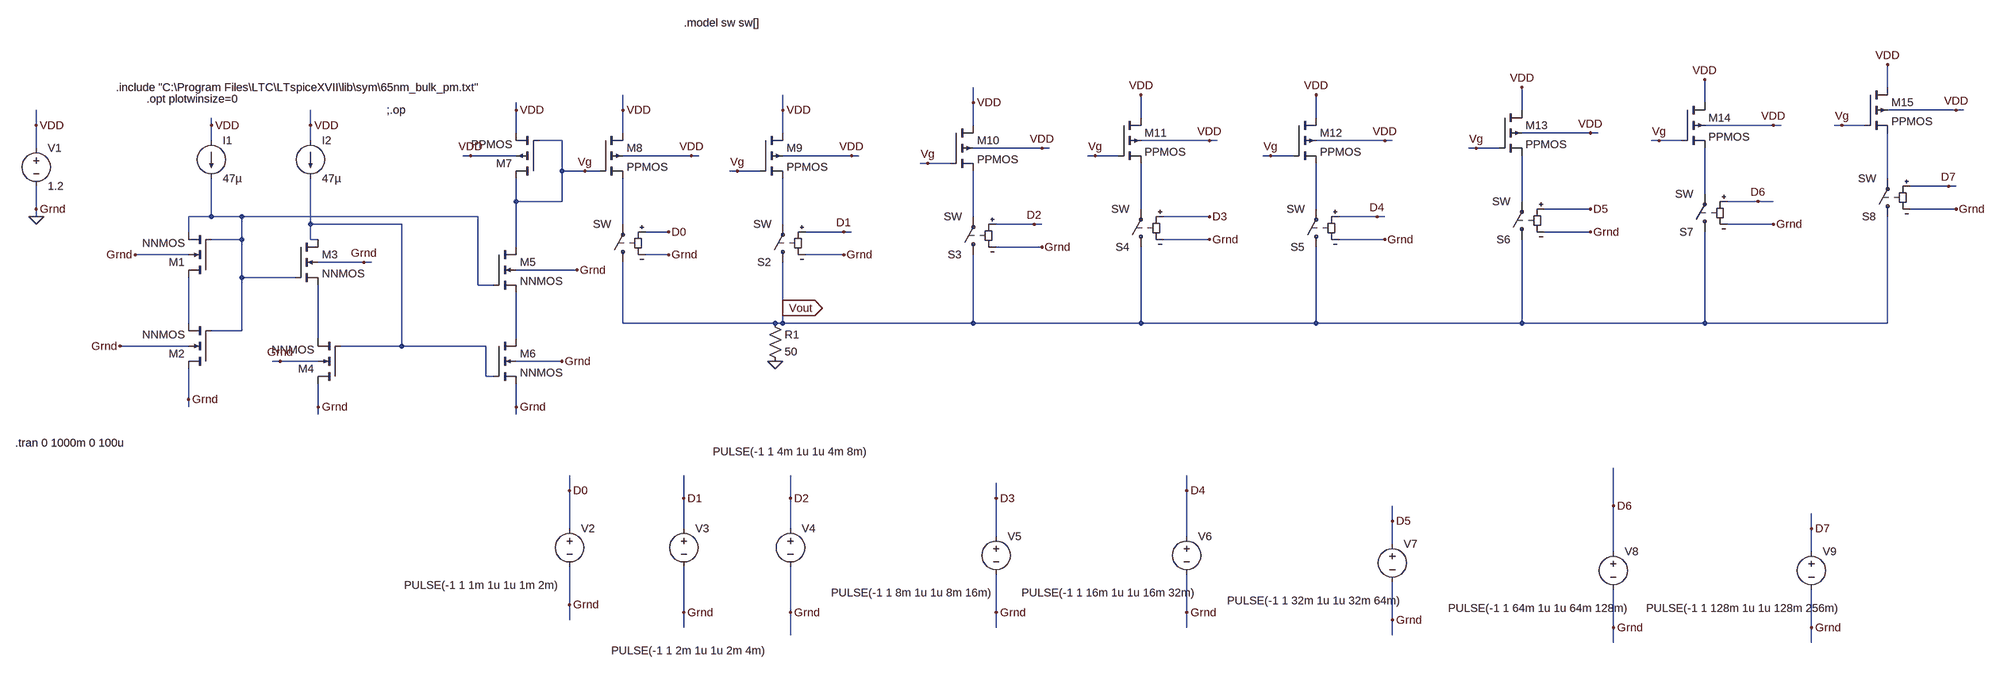
[diagram p0: schematic 8bitDAC.asc]
8bitDAC.asc, the LTspice schematic file:
Version 4
SHEET 1 3804 680
WIRE 3584 -624 3584 -672
WIRE 1664 -592 1664 -624
WIRE 3200 -592 3200 -640
WIRE 704 -576 704 -592
WIRE 928 -576 928 -608
WIRE 1264 -576 1264 -608
WIRE 2816 -576 2816 -624
WIRE 3728 -576 3584 -576
WIRE 3744 -576 3728 -576
WIRE 2016 -560 2016 -608
WIRE 2384 -560 2384 -608
WIRE -304 -544 -304 -576
WIRE 64 -544 64 -560
WIRE 272 -544 272 -576
WIRE 1664 -544 1664 -592
WIRE 3344 -544 3200 -544
WIRE 3360 -544 3344 -544
WIRE 3488 -544 3472 -544
WIRE 3536 -544 3488 -544
WIRE 704 -528 704 -576
WIRE 928 -528 928 -576
WIRE 1264 -528 1264 -576
WIRE 2960 -528 2816 -528
WIRE 2976 -528 2960 -528
WIRE 64 -512 64 -544
WIRE 272 -512 272 -544
WIRE 800 -512 752 -512
WIRE 2160 -512 2016 -512
WIRE 2176 -512 2160 -512
WIRE 2528 -512 2384 -512
WIRE 2544 -512 2528 -512
WIRE 3104 -512 3088 -512
WIRE 3152 -512 3104 -512
WIRE -304 -496 -304 -544
WIRE 1808 -496 1664 -496
WIRE 1824 -496 1808 -496
WIRE 2720 -496 2704 -496
WIRE 2768 -496 2720 -496
WIRE 608 -480 592 -480
WIRE 704 -480 608 -480
WIRE 1072 -480 928 -480
WIRE 1088 -480 1072 -480
WIRE 1408 -480 1264 -480
WIRE 1424 -480 1408 -480
WIRE 1920 -480 1904 -480
WIRE 1968 -480 1920 -480
WIRE 2288 -480 2272 -480
WIRE 2336 -480 2288 -480
WIRE 1568 -464 1552 -464
WIRE 1616 -464 1568 -464
WIRE 800 -448 800 -512
WIRE 848 -448 800 -448
WIRE 880 -448 848 -448
WIRE 1168 -448 1152 -448
WIRE 1216 -448 1168 -448
WIRE 3584 -432 3584 -528
WIRE 3712 -416 3632 -416
WIRE 3728 -416 3712 -416
WIRE 3200 -400 3200 -496
WIRE 704 -384 704 -432
WIRE 800 -384 800 -448
WIRE 800 -384 704 -384
WIRE 2816 -384 2816 -480
WIRE 3312 -384 3248 -384
WIRE 3344 -384 3312 -384
WIRE -304 -368 -304 -416
WIRE 2016 -368 2016 -464
WIRE 2384 -368 2384 -464
WIRE 2960 -368 2864 -368
WIRE 3728 -368 3632 -368
WIRE -304 -352 -304 -368
WIRE 64 -352 64 -432
WIRE 64 -352 16 -352
WIRE 128 -352 64 -352
WIRE 624 -352 128 -352
WIRE 1664 -352 1664 -448
WIRE 2160 -352 2064 -352
WIRE 2512 -352 2432 -352
WIRE 2528 -352 2512 -352
WIRE 272 -336 272 -432
WIRE 464 -336 272 -336
WIRE 928 -336 928 -432
WIRE 1264 -336 1264 -432
WIRE 1792 -336 1712 -336
WIRE 1808 -336 1792 -336
WIRE 3344 -336 3248 -336
WIRE 16 -320 16 -352
WIRE 1024 -320 976 -320
WIRE 1392 -320 1312 -320
WIRE 1408 -320 1392 -320
WIRE 2960 -320 2864 -320
WIRE 128 -304 128 -352
WIRE 128 -304 64 -304
WIRE 272 -304 272 -336
WIRE 288 -304 272 -304
WIRE 2160 -304 2064 -304
WIRE 2528 -304 2432 -304
WIRE 704 -288 704 -384
WIRE 1808 -288 1712 -288
WIRE 16 -272 -96 -272
WIRE 1024 -272 976 -272
WIRE 1392 -272 1312 -272
WIRE 384 -256 288 -256
WIRE 400 -256 384 -256
WIRE 832 -240 704 -240
WIRE 128 -224 128 -304
WIRE 240 -224 128 -224
WIRE 624 -208 624 -352
WIRE 656 -208 624 -208
WIRE 1264 -160 1264 -256
WIRE 16 -128 16 -224
WIRE 928 -128 928 -256
WIRE 1248 -128 928 -128
WIRE 1264 -128 1264 -160
WIRE 1264 -128 1248 -128
WIRE 1664 -128 1664 -272
WIRE 1664 -128 1264 -128
WIRE 2016 -128 2016 -288
WIRE 2016 -128 1664 -128
WIRE 2384 -128 2384 -288
WIRE 2384 -128 2016 -128
WIRE 2816 -128 2816 -304
WIRE 2816 -128 2384 -128
WIRE 3200 -128 3200 -320
WIRE 3200 -128 2816 -128
WIRE 3584 -128 3584 -352
WIRE 3584 -128 3200 -128
WIRE 128 -112 128 -224
WIRE 128 -112 64 -112
WIRE 288 -96 288 -208
WIRE 704 -96 704 -192
WIRE 16 -80 -128 -80
WIRE 464 -80 464 -336
WIRE 464 -80 336 -80
WIRE 640 -80 464 -80
WIRE 208 -48 192 -48
WIRE 288 -48 208 -48
WIRE 800 -48 704 -48
WIRE 640 -16 640 -80
WIRE 656 -16 640 -16
WIRE 16 32 16 -32
WIRE 16 48 16 32
WIRE 288 48 288 0
WIRE 704 48 704 0
WIRE 288 64 288 48
WIRE 704 64 704 48
WIRE 816 224 816 192
WIRE 2112 224 2112 192
WIRE 1056 240 1056 192
WIRE 1280 240 1280 192
WIRE 1712 240 1712 208
WIRE 3008 256 3008 176
WIRE 2544 288 2544 256
WIRE 816 304 816 224
WIRE 1056 304 1056 240
WIRE 1280 304 1280 240
WIRE 3424 304 3424 272
WIRE 1712 320 1712 240
WIRE 2112 320 2112 224
WIRE 2544 336 2544 288
WIRE 3008 352 3008 256
WIRE 3424 352 3424 304
WIRE 816 464 816 384
WIRE 1056 480 1056 384
WIRE 1280 480 1280 384
WIRE 1712 480 1712 400
WIRE 2112 480 2112 400
WIRE 816 496 816 464
WIRE 2544 496 2544 416
WIRE 1056 512 1056 480
WIRE 1712 512 1712 480
WIRE 2112 512 2112 480
WIRE 3008 512 3008 432
WIRE 3424 512 3424 432
WIRE 1280 528 1280 480
WIRE 2544 528 2544 496
WIRE 3008 544 3008 512
WIRE 3424 544 3424 512
FLAG -304 -352 0
FLAG -304 -544 VDD
FLAG 64 -544 VDD
FLAG 272 -544 VDD
FLAG -304 -368 Grnd
FLAG -96 -272 Grnd
FLAG -128 -80 Grnd
FLAG 16 32 Grnd
FLAG 288 48 Grnd
FLAG 208 -48 Grnd
FLAG 800 -48 Grnd
FLAG 704 48 Grnd
FLAG 832 -240 Grnd
FLAG 384 -256 Grnd
FLAG 704 -576 VDD
FLAG 608 -480 VDD
FLAG 928 -576 VDD
FLAG 1072 -480 VDD
FLAG 848 -448 Vg
FLAG 1264 -576 VDD
FLAG 1408 -480 VDD
FLAG 1168 -448 Vg
FLAG 1664 -592 VDD
FLAG 1808 -496 VDD
FLAG 1568 -464 Vg
FLAG 1248 -48 0
FLAG 1024 -272 Grnd
FLAG 1392 -272 Grnd
FLAG 1808 -288 Grnd
FLAG 816 464 Grnd
FLAG 1056 480 Grnd
FLAG 1280 480 Grnd
FLAG 816 224 D0
FLAG 1024 -320 D0
FLAG 1056 240 D1
FLAG 1392 -320 D1
FLAG 1792 -336 D2
FLAG 1280 240 D2
FLAG 1264 -160 Vout
IOPIN 1264 -160 Out
FLAG 1712 480 Grnd
FLAG 2112 480 Grnd
FLAG 2544 496 Grnd
FLAG 3008 512 Grnd
FLAG 3424 512 Grnd
FLAG 2016 -608 VDD
FLAG 2160 -512 VDD
FLAG 1920 -480 Vg
FLAG 2160 -304 Grnd
FLAG 2384 -608 VDD
FLAG 2528 -512 VDD
FLAG 2288 -480 Vg
FLAG 2528 -304 Grnd
FLAG 2816 -624 VDD
FLAG 2960 -528 VDD
FLAG 2720 -496 Vg
FLAG 2960 -320 Grnd
FLAG 3200 -640 VDD
FLAG 3344 -544 VDD
FLAG 3104 -512 Vg
FLAG 3344 -336 Grnd
FLAG 3584 -672 VDD
FLAG 3728 -576 VDD
FLAG 3488 -544 Vg
FLAG 3728 -368 Grnd
FLAG 1712 240 D3
FLAG 2160 -352 D3
FLAG 2112 224 D4
FLAG 2512 -352 D4
FLAG 2544 288 D5
FLAG 2960 -368 D5
FLAG 3312 -384 D6
FLAG 3008 256 D6
FLAG 3712 -416 D7
FLAG 3424 304 D7
SYMBOL current 64 -512 R0
WINDOW 123 0 0 Left 0
WINDOW 39 0 0 Left 0
SYMATTR InstName I1
SYMATTR Value 47µ
SYMBOL current 272 -512 R0
WINDOW 123 0 0 Left 0
WINDOW 39 0 0 Left 0
SYMATTR InstName I2
SYMATTR Value 47µ
SYMBOL nmos4 64 -224 R180
SYMATTR InstName M1
SYMATTR Value NNMOS
SYMATTR Value2 l=0.3u w=6u
SYMBOL nmos4 64 -32 R180
SYMATTR InstName M2
SYMATTR Value NNMOS
SYMATTR Value2 l=0.3u w=2u
SYMBOL nmos4 240 -304 R0
SYMATTR InstName M3
SYMATTR Value NNMOS
SYMATTR Value2 l=0.3u w=6u
SYMBOL nmos4 336 0 R180
SYMATTR InstName M4
SYMATTR Value NNMOS
SYMATTR Value2 l=0.3u w=6u
SYMBOL nmos4 656 -288 R0
SYMATTR InstName M5
SYMATTR Value NNMOS
SYMATTR Value2 l=0.3u w=6u
SYMBOL nmos4 656 -96 R0
SYMATTR InstName M6
SYMATTR Value NNMOS
SYMATTR Value2 l=0.3u w=6u
SYMBOL voltage -304 -512 R0
WINDOW 123 0 0 Left 0
WINDOW 39 0 0 Left 0
SYMATTR InstName V1
SYMATTR Value 1.2
SYMBOL pmos4 752 -432 R180
SYMATTR InstName M7
SYMATTR Value PPMOS
SYMATTR Value2 l=0.3u w=6u
SYMBOL pmos4 880 -528 R0
SYMATTR InstName M8
SYMATTR Value PPMOS
SYMATTR Value2 l=0.3u w=6u
SYMBOL pmos4 1216 -528 R0
SYMATTR InstName M9
SYMATTR Value PPMOS
SYMATTR Value2 l=0.3u w=6u m=2
SYMBOL pmos4 1616 -544 R0
SYMATTR InstName M10
SYMATTR Value PPMOS
SYMATTR Value2 l=0.3u w=6u m=4
SYMBOL sw 928 -240 R180
WINDOW 0 24 16 Invisible 2
SYMATTR InstName S1
SYMBOL sw 1264 -240 R180
SYMATTR InstName S2
SYMBOL sw 1664 -256 R180
SYMATTR InstName S3
SYMBOL res 1232 -144 R0
SYMATTR InstName R1
SYMATTR Value 50
SYMBOL voltage 816 288 R0
WINDOW 3 -347 135 Left 2
WINDOW 123 0 0 Left 0
WINDOW 39 0 0 Left 0
SYMATTR InstName V2
SYMATTR Value PULSE(-1 1 1m 1u 1u 1m 2m)
SYMBOL voltage 1056 288 R0
WINDOW 3 -152 272 Left 2
WINDOW 123 0 0 Left 0
WINDOW 39 0 0 Left 0
SYMATTR InstName V3
SYMATTR Value PULSE(-1 1 2m 1u 1u 2m 4m)
SYMBOL voltage 1280 288 R0
WINDOW 3 -163 -146 Left 2
WINDOW 123 0 0 Left 0
WINDOW 39 0 0 Left 0
SYMATTR InstName V4
SYMATTR Value PULSE(-1 1 4m 1u 1u 4m 8m)
SYMBOL voltage 1712 304 R0
WINDOW 3 -347 135 Left 2
WINDOW 123 0 0 Left 0
WINDOW 39 0 0 Left 0
SYMATTR InstName V5
SYMATTR Value PULSE(-1 1 8m 1u 1u 8m 16m)
SYMBOL voltage 2112 304 R0
WINDOW 3 -347 135 Left 2
WINDOW 123 0 0 Left 0
WINDOW 39 0 0 Left 0
SYMATTR InstName V6
SYMATTR Value PULSE(-1 1 16m 1u 1u 16m 32m)
SYMBOL voltage 2544 320 R0
WINDOW 3 -347 135 Left 2
WINDOW 123 0 0 Left 0
WINDOW 39 0 0 Left 0
SYMATTR InstName V7
SYMATTR Value PULSE(-1 1 32m 1u 1u 32m 64m)
SYMBOL voltage 3008 336 R0
WINDOW 3 -347 135 Left 2
WINDOW 123 0 0 Left 0
WINDOW 39 0 0 Left 0
SYMATTR InstName V8
SYMATTR Value PULSE(-1 1 64m 1u 1u 64m 128m)
SYMBOL voltage 3424 336 R0
WINDOW 3 -347 135 Left 2
WINDOW 123 0 0 Left 0
WINDOW 39 0 0 Left 0
SYMATTR InstName V9
SYMATTR Value PULSE(-1 1 128m 1u 1u 128m 256m)
SYMBOL pmos4 1968 -560 R0
SYMATTR InstName M11
SYMATTR Value PPMOS
SYMATTR Value2 l=0.3u w=6u m=8
SYMBOL sw 2016 -272 R180
SYMATTR InstName S4
SYMBOL pmos4 2336 -560 R0
SYMATTR InstName M12
SYMATTR Value PPMOS
SYMATTR Value2 l=0.3u w=6u m=16
SYMBOL sw 2384 -272 R180
SYMATTR InstName S5
SYMBOL pmos4 2768 -576 R0
SYMATTR InstName M13
SYMATTR Value PPMOS
SYMATTR Value2 l=0.3u w=6u m=32
SYMBOL sw 2816 -288 R180
SYMATTR InstName S6
SYMBOL pmos4 3152 -592 R0
SYMATTR InstName M14
SYMATTR Value PPMOS
SYMATTR Value2 l=0.3u w=6u m=64
SYMBOL sw 3200 -304 R180
SYMATTR InstName S7
SYMBOL pmos4 3536 -624 R0
SYMATTR InstName M15
SYMATTR Value PPMOS
SYMATTR Value2 l=0.3u w=6u m=128
SYMBOL sw 3584 -336 R180
SYMATTR InstName S8
TEXT -136 -624 Left 2 !.include "C:\\Program Files\\LTC\\LTspiceXVII\\lib\\sym\\65nm_bulk_pm.txt"
TEXT -72 -600 Left 2 !.opt plotwinsize=0
TEXT 432 -576 Left 2 !;.op
TEXT -348 124 Left 2 !.tran 0 1000m 0 100u
TEXT 1056 -760 Left 2 !.model sw sw[]

The netlist it stands for:
* 8bitDAC.asc
I1 VDD N006 47µ
I2 VDD N008 47µ
M1 N011 N006 N006 0 NNMOS l=0.3u w=6u
M2 0 N006 N011 0 NNMOS l=0.3u w=2u
M3 N008 N006 N012 0 NNMOS l=0.3u w=6u
M4 0 N008 N012 0 NNMOS l=0.3u w=6u
M5 Vg N006 N013 0 NNMOS l=0.3u w=6u
M6 N013 N008 0 0 NNMOS l=0.3u w=6u
V1 VDD 0 1.2
M7 Vg Vg VDD VDD PPMOS l=0.3u w=6u
M8 VDD Vg N009 VDD PPMOS l=0.3u w=6u
M9 VDD Vg N010 VDD PPMOS l=0.3u w=6u m=2
M10 VDD Vg N007 VDD PPMOS l=0.3u w=6u m=4
S1 Vout N009 D0 0 SW
S2 Vout N010 D1 0 SW
S3 Vout N007 D2 0 SW
R1 Vout 0 50
V2 D0 0 PULSE(-1 1 1m 1u 1u 1m 2m)
V3 D1 0 PULSE(-1 1 2m 1u 1u 2m 4m)
V4 D2 0 PULSE(-1 1 4m 1u 1u 4m 8m)
V5 D3 0 PULSE(-1 1 8m 1u 1u 8m 16m)
V6 D4 0 PULSE(-1 1 16m 1u 1u 16m 32m)
V7 D5 0 PULSE(-1 1 32m 1u 1u 32m 64m)
V8 D6 0 PULSE(-1 1 64m 1u 1u 64m 128m)
V9 D7 0 PULSE(-1 1 128m 1u 1u 128m 256m)
M11 VDD Vg N004 VDD PPMOS l=0.3u w=6u m=8
S4 Vout N004 D3 0 SW
M12 VDD Vg N005 VDD PPMOS l=0.3u w=6u m=16
S5 Vout N005 D4 0 SW
M13 VDD Vg N003 VDD PPMOS l=0.3u w=6u m=32
S6 Vout N003 D5 0 SW
M14 VDD Vg N002 VDD PPMOS l=0.3u w=6u m=64
S7 Vout N002 D6 0 SW
M15 VDD Vg N001 VDD PPMOS l=0.3u w=6u m=128
S8 Vout N001 D7 0 SW
.model NMOS NMOS
.model PMOS PMOS
.lib standard.mos
.include "C:\Program Files\LTC\LTspiceXVII\lib\sym\65nm_bulk_pm.txt"
.opt plotwinsize=0
;.op
.tran 0 1000m 0 100u
.model sw sw[]
.backanno
.end